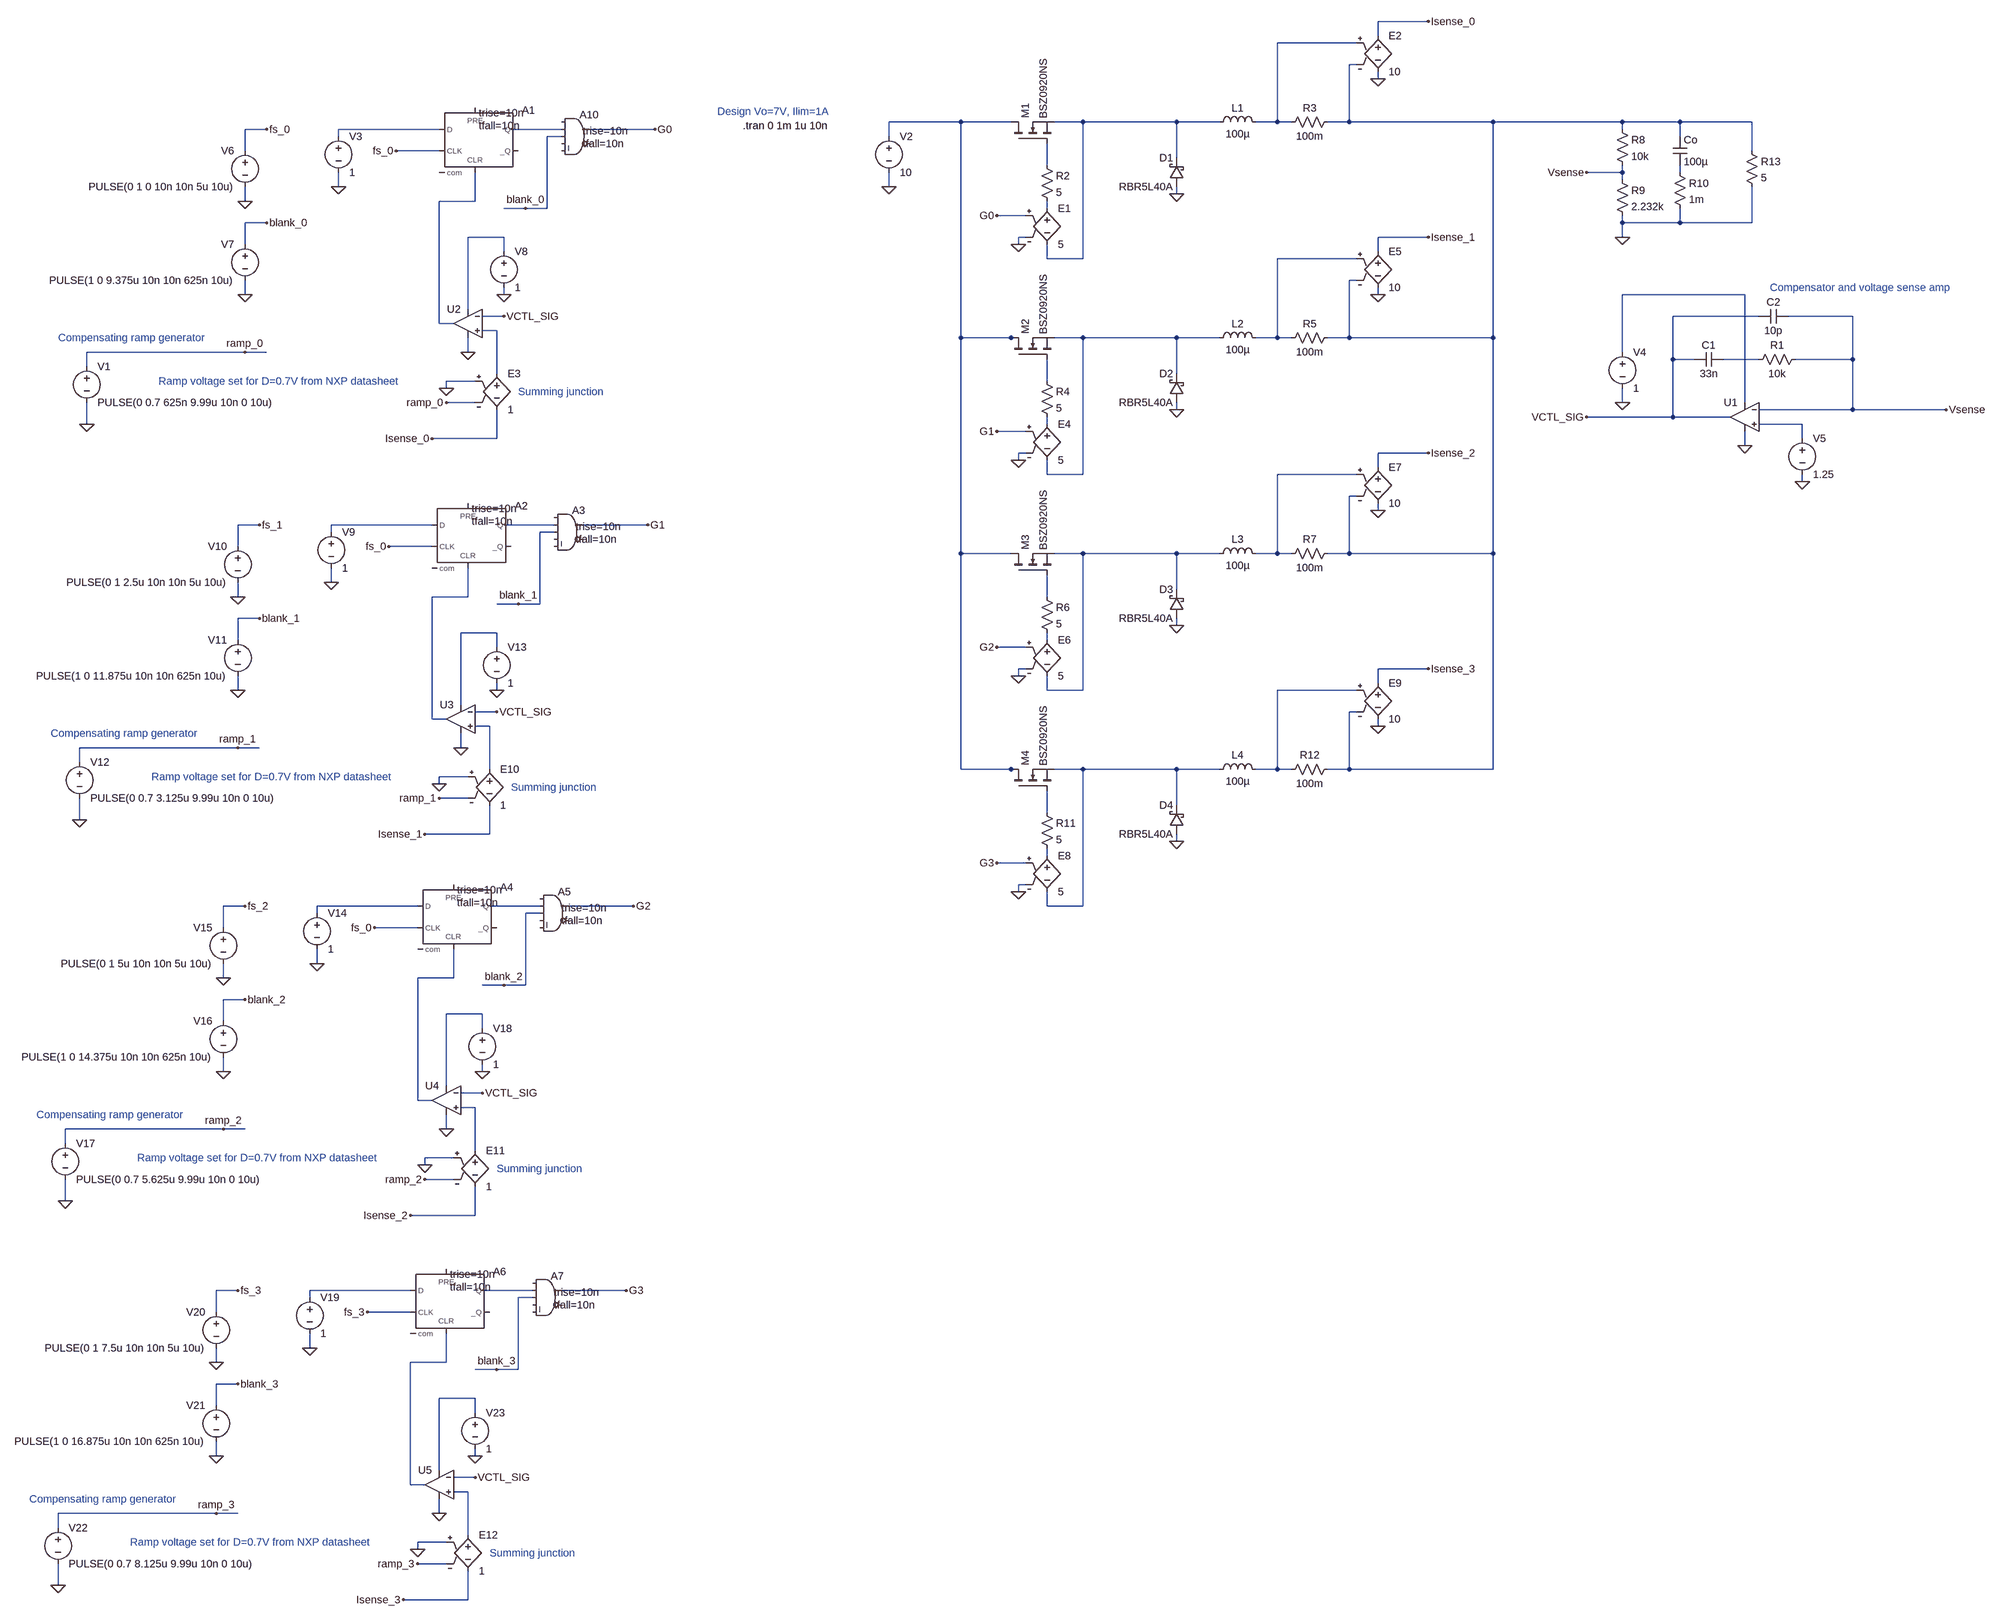
[diagram p0: schematic QuadPhase.asc]
QuadPhase.asc, the LTspice schematic file:
Version 4
SHEET 1 3300 3484
WIRE 1088 -112 976 -112
WIRE 976 -80 976 -112
WIRE 928 -64 752 -64
WIRE 928 -16 912 -16
WIRE 976 16 976 0
WIRE 48 112 -112 112
WIRE 160 112 48 112
WIRE 320 112 256 112
WIRE 528 112 320 112
WIRE 624 112 528 112
WIRE 752 112 752 -64
WIRE 752 112 704 112
WIRE 784 112 752 112
WIRE 912 112 912 -16
WIRE 912 112 864 112
WIRE 1232 112 912 112
WIRE 1520 112 1232 112
WIRE 1648 112 1520 112
WIRE 1808 112 1648 112
WIRE -1840 128 -1888 128
WIRE -1456 128 -1680 128
WIRE -1184 128 -1296 128
WIRE -976 128 -1120 128
WIRE 1520 128 1520 112
WIRE -1680 144 -1680 128
WIRE -1184 144 -1216 144
WIRE -112 144 -112 112
WIRE 1648 144 1648 112
WIRE -1888 176 -1888 128
WIRE -1456 176 -1552 176
WIRE 1808 176 1808 112
WIRE 528 192 528 112
WIRE 240 208 240 160
WIRE 1520 224 1520 208
WIRE 1520 224 1440 224
WIRE 1648 224 1648 208
WIRE 1520 240 1520 224
WIRE -1680 256 -1680 224
WIRE -112 256 -112 224
WIRE 528 272 528 256
WIRE -1888 288 -1888 256
WIRE -1376 288 -1376 224
WIRE -1376 288 -1456 288
WIRE -1264 304 -1312 304
WIRE -1216 304 -1216 144
WIRE -1216 304 -1264 304
WIRE 240 304 240 288
WIRE 192 320 128 320
WIRE -1840 336 -1888 336
WIRE 1520 336 1520 320
WIRE 1648 336 1648 304
WIRE 1648 336 1520 336
WIRE 1808 336 1808 256
WIRE 1808 336 1648 336
WIRE -1312 368 -1392 368
WIRE 192 368 176 368
WIRE 1088 368 976 368
WIRE 1520 368 1520 336
WIRE -1888 384 -1888 336
WIRE 176 384 176 368
WIRE -1312 400 -1312 368
WIRE 976 400 976 368
WIRE 240 416 240 384
WIRE 320 416 320 112
WIRE 320 416 240 416
WIRE 928 416 752 416
WIRE 928 464 912 464
WIRE -1888 496 -1888 464
WIRE -1312 496 -1312 480
WIRE 976 496 976 480
WIRE 1792 496 1520 496
WIRE -1392 528 -1392 368
WIRE -1312 544 -1360 544
WIRE 1824 544 1632 544
WIRE 2032 544 1888 544
WIRE -1456 560 -1456 288
WIRE -1424 560 -1456 560
WIRE -1328 576 -1360 576
WIRE 48 592 48 112
WIRE 160 592 48 592
WIRE 176 592 160 592
WIRE 320 592 256 592
WIRE 528 592 320 592
WIRE 624 592 528 592
WIRE 752 592 752 416
WIRE 752 592 704 592
WIRE 784 592 752 592
WIRE 912 592 912 464
WIRE 912 592 864 592
WIRE 1232 592 1232 112
WIRE 1232 592 912 592
WIRE -1888 624 -2240 624
WIRE -1840 624 -1888 624
WIRE -1392 624 -1392 592
WIRE 1520 624 1520 496
WIRE 1632 640 1632 544
WIRE 1680 640 1632 640
WIRE 1824 640 1744 640
WIRE 2032 640 2032 544
WIRE 2032 640 1904 640
WIRE -2240 656 -2240 624
WIRE -1328 672 -1328 576
WIRE 528 672 528 592
WIRE -1376 688 -1440 688
WIRE 240 688 240 640
WIRE -1440 704 -1440 688
WIRE -1376 736 -1440 736
WIRE 1520 736 1520 704
WIRE 1792 736 1792 496
WIRE 528 752 528 736
WIRE 2032 752 2032 640
WIRE 2032 752 1824 752
WIRE 2240 752 2032 752
WIRE 1632 768 1632 640
WIRE 1632 768 1440 768
WIRE 1760 768 1632 768
WIRE -2240 784 -2240 736
WIRE 240 784 240 768
WIRE 1920 784 1824 784
WIRE 192 800 128 800
WIRE -1328 816 -1328 752
WIRE -1328 816 -1472 816
WIRE 1920 816 1920 784
WIRE 1792 832 1792 800
WIRE 192 848 176 848
WIRE 1088 848 976 848
WIRE 176 864 176 848
WIRE 976 880 976 848
WIRE 240 896 240 864
WIRE 320 896 320 592
WIRE 320 896 240 896
WIRE 928 896 752 896
WIRE 1920 912 1920 896
WIRE 928 944 912 944
WIRE 976 976 976 960
WIRE -1856 1008 -1904 1008
WIRE -1472 1008 -1696 1008
WIRE -1200 1008 -1312 1008
WIRE -992 1008 -1136 1008
WIRE -1696 1024 -1696 1008
WIRE -1200 1024 -1232 1024
WIRE -1904 1056 -1904 1008
WIRE -1472 1056 -1568 1056
WIRE 48 1072 48 592
WIRE 160 1072 48 1072
WIRE 320 1072 256 1072
WIRE 528 1072 320 1072
WIRE 624 1072 528 1072
WIRE 752 1072 752 896
WIRE 752 1072 704 1072
WIRE 784 1072 752 1072
WIRE 912 1072 912 944
WIRE 912 1072 864 1072
WIRE 1232 1072 1232 592
WIRE 1232 1072 912 1072
WIRE -1696 1136 -1696 1104
WIRE 528 1152 528 1072
WIRE -1904 1168 -1904 1136
WIRE -1392 1168 -1392 1104
WIRE -1392 1168 -1472 1168
WIRE 240 1168 240 1120
WIRE -1280 1184 -1328 1184
WIRE -1232 1184 -1232 1024
WIRE -1232 1184 -1280 1184
WIRE -1856 1216 -1904 1216
WIRE 528 1232 528 1216
WIRE -1328 1248 -1408 1248
WIRE -1904 1264 -1904 1216
WIRE 240 1264 240 1248
WIRE -1328 1280 -1328 1248
WIRE 192 1280 128 1280
WIRE 192 1328 176 1328
WIRE 1088 1328 976 1328
WIRE 176 1344 176 1328
WIRE 976 1360 976 1328
WIRE -1904 1376 -1904 1344
WIRE -1328 1376 -1328 1360
WIRE 240 1376 240 1344
WIRE 320 1376 320 1072
WIRE 320 1376 240 1376
WIRE 928 1376 752 1376
WIRE -1408 1408 -1408 1248
WIRE -1328 1424 -1376 1424
WIRE 928 1424 912 1424
WIRE -1472 1440 -1472 1168
WIRE -1440 1440 -1472 1440
WIRE -1344 1456 -1376 1456
WIRE 976 1456 976 1440
WIRE -1904 1504 -2256 1504
WIRE -1856 1504 -1904 1504
WIRE -1408 1504 -1408 1472
WIRE -2256 1536 -2256 1504
WIRE -1344 1552 -1344 1456
WIRE 48 1552 48 1072
WIRE 160 1552 48 1552
WIRE 176 1552 160 1552
WIRE 320 1552 256 1552
WIRE 528 1552 320 1552
WIRE 624 1552 528 1552
WIRE 752 1552 752 1376
WIRE 752 1552 704 1552
WIRE 784 1552 752 1552
WIRE 912 1552 912 1424
WIRE 912 1552 864 1552
WIRE 1232 1552 1232 1072
WIRE 1232 1552 912 1552
WIRE -1392 1568 -1456 1568
WIRE -1456 1584 -1456 1568
WIRE -1392 1616 -1456 1616
WIRE 528 1632 528 1552
WIRE 240 1648 240 1600
WIRE -2256 1664 -2256 1616
WIRE -1344 1696 -1344 1632
WIRE -1344 1696 -1488 1696
WIRE 528 1712 528 1696
WIRE 240 1744 240 1728
WIRE 192 1760 128 1760
WIRE 192 1808 176 1808
WIRE 176 1824 176 1808
WIRE -1888 1856 -1936 1856
WIRE -1504 1856 -1728 1856
WIRE -1232 1856 -1344 1856
WIRE -1024 1856 -1168 1856
WIRE 240 1856 240 1824
WIRE 320 1856 320 1552
WIRE 320 1856 240 1856
WIRE -1728 1872 -1728 1856
WIRE -1232 1872 -1264 1872
WIRE -1936 1904 -1936 1856
WIRE -1504 1904 -1600 1904
WIRE -1728 1984 -1728 1952
WIRE -1936 2016 -1936 1984
WIRE -1424 2016 -1424 1952
WIRE -1424 2016 -1504 2016
WIRE -1312 2032 -1360 2032
WIRE -1264 2032 -1264 1872
WIRE -1264 2032 -1312 2032
WIRE -1888 2064 -1936 2064
WIRE -1360 2096 -1440 2096
WIRE -1936 2112 -1936 2064
WIRE -1360 2128 -1360 2096
WIRE -1936 2224 -1936 2192
WIRE -1360 2224 -1360 2208
WIRE -1440 2256 -1440 2096
WIRE -1360 2272 -1408 2272
WIRE -1504 2288 -1504 2016
WIRE -1472 2288 -1504 2288
WIRE -1376 2304 -1408 2304
WIRE -1936 2352 -2288 2352
WIRE -1888 2352 -1936 2352
WIRE -1440 2352 -1440 2320
WIRE -2288 2384 -2288 2352
WIRE -1376 2400 -1376 2304
WIRE -1424 2416 -1488 2416
WIRE -1488 2432 -1488 2416
WIRE -1424 2464 -1488 2464
WIRE -2288 2512 -2288 2464
WIRE -1376 2544 -1376 2480
WIRE -1376 2544 -1520 2544
WIRE -1904 2736 -1952 2736
WIRE -1520 2736 -1744 2736
WIRE -1248 2736 -1360 2736
WIRE -1040 2736 -1184 2736
WIRE -1744 2752 -1744 2736
WIRE -1248 2752 -1280 2752
WIRE -1952 2784 -1952 2736
WIRE -1520 2784 -1616 2784
WIRE -1744 2864 -1744 2832
WIRE -1952 2896 -1952 2864
WIRE -1440 2896 -1440 2832
WIRE -1440 2896 -1520 2896
WIRE -1328 2912 -1376 2912
WIRE -1280 2912 -1280 2752
WIRE -1280 2912 -1328 2912
WIRE -1904 2944 -1952 2944
WIRE -1376 2976 -1456 2976
WIRE -1952 2992 -1952 2944
WIRE -1376 3008 -1376 2976
WIRE -1952 3104 -1952 3072
WIRE -1376 3104 -1376 3088
WIRE -1456 3136 -1456 2976
WIRE -1376 3152 -1424 3152
WIRE -1520 3168 -1520 2896
WIRE -1488 3168 -1520 3168
WIRE -1392 3184 -1424 3184
WIRE -1952 3232 -2304 3232
WIRE -1904 3232 -1952 3232
WIRE -1456 3232 -1456 3200
WIRE -2304 3264 -2304 3232
WIRE -1392 3280 -1392 3184
WIRE -1440 3296 -1504 3296
WIRE -1504 3312 -1504 3296
WIRE -1440 3344 -1504 3344
WIRE -2304 3392 -2304 3344
WIRE -1392 3424 -1392 3360
WIRE -1392 3424 -1536 3424
FLAG -112 256 0
FLAG 528 272 0
FLAG 176 384 0
FLAG -1680 256 0
FLAG 976 16 0
FLAG 1088 -112 Isense_0
FLAG -1552 176 fs_0
FLAG -1264 304 blank_0
FLAG 1440 224 Vsense
FLAG -1888 288 0
FLAG -1840 128 fs_0
FLAG -1888 496 0
FLAG -1840 336 blank_0
FLAG -2240 784 0
FLAG -1888 624 ramp_0
FLAG -1472 816 Isense_0
FLAG -1440 704 0
FLAG -1440 736 ramp_0
FLAG 1792 832 0
FLAG 1520 736 0
FLAG 1920 912 0
FLAG 2240 752 Vsense
FLAG -1312 496 0
FLAG -1392 624 0
FLAG 1440 768 VCTL_SIG
FLAG -1312 544 VCTL_SIG
FLAG -976 128 G0
FLAG 128 320 G0
FLAG 528 752 0
FLAG 176 864 0
FLAG 976 496 0
FLAG 1088 368 Isense_1
FLAG 128 800 G1
FLAG 1520 368 0
FLAG 528 1232 0
FLAG 176 1344 0
FLAG 976 976 0
FLAG 1088 848 Isense_2
FLAG 128 1280 G2
FLAG 528 1712 0
FLAG 176 1824 0
FLAG 976 1456 0
FLAG 1088 1328 Isense_3
FLAG 128 1760 G3
FLAG -1696 1136 0
FLAG -1568 1056 fs_0
FLAG -1280 1184 blank_1
FLAG -1904 1168 0
FLAG -1856 1008 fs_1
FLAG -1904 1376 0
FLAG -1856 1216 blank_1
FLAG -2256 1664 0
FLAG -1904 1504 ramp_1
FLAG -1488 1696 Isense_1
FLAG -1456 1584 0
FLAG -1456 1616 ramp_1
FLAG -1328 1376 0
FLAG -1408 1504 0
FLAG -1328 1424 VCTL_SIG
FLAG -992 1008 G1
FLAG -1728 1984 0
FLAG -1600 1904 fs_0
FLAG -1312 2032 blank_2
FLAG -1936 2016 0
FLAG -1888 1856 fs_2
FLAG -1936 2224 0
FLAG -1888 2064 blank_2
FLAG -2288 2512 0
FLAG -1936 2352 ramp_2
FLAG -1520 2544 Isense_2
FLAG -1488 2432 0
FLAG -1488 2464 ramp_2
FLAG -1360 2224 0
FLAG -1440 2352 0
FLAG -1360 2272 VCTL_SIG
FLAG -1024 1856 G2
FLAG -1744 2864 0
FLAG -1616 2784 fs_3
FLAG -1328 2912 blank_3
FLAG -1952 2896 0
FLAG -1904 2736 fs_3
FLAG -1952 3104 0
FLAG -1904 2944 blank_3
FLAG -2304 3392 0
FLAG -1952 3232 ramp_3
FLAG -1536 3424 Isense_3
FLAG -1504 3312 0
FLAG -1504 3344 ramp_3
FLAG -1376 3104 0
FLAG -1456 3232 0
FLAG -1376 3152 VCTL_SIG
FLAG -1040 2736 G3
SYMBOL nmos 160 160 R270
SYMATTR InstName M1
SYMATTR Value BSZ0920NS
SYMBOL voltage -112 128 R0
WINDOW 123 0 0 Left 0
WINDOW 39 0 0 Left 0
SYMATTR InstName V2
SYMATTR Value 10
SYMBOL res 224 192 R0
SYMATTR InstName R2
SYMATTR Value 5
SYMBOL schottky 544 256 R180
WINDOW 0 24 64 Left 2
WINDOW 3 24 0 Left 2
SYMATTR InstName D1
SYMATTR Value RBR5L40A
SYMATTR Description Diode
SYMATTR Type diode
SYMBOL ind 608 128 R270
WINDOW 0 32 56 VTop 2
WINDOW 3 5 56 VBottom 2
SYMATTR InstName L1
SYMATTR Value 100µ
SYMATTR SpiceLine Rser=0.115 Cpar=7.036p
SYMBOL cap 1632 144 R0
SYMATTR InstName Co
SYMATTR Value 100µ
SYMBOL res 880 96 R90
WINDOW 0 0 56 VBottom 2
WINDOW 3 32 56 VTop 2
SYMATTR InstName R3
SYMATTR Value 100m
SYMBOL Digital\\dflop -1376 80 R0
WINDOW 3 8 12 Left 2
WINDOW 123 8 40 Left 2
SYMATTR Value trise=10n
SYMATTR Value2 tfall=10n
SYMATTR InstName A1
SYMBOL e 240 288 R0
SYMATTR InstName E1
SYMATTR Value 5
SYMBOL voltage -1680 128 R0
WINDOW 123 0 0 Left 0
WINDOW 39 0 0 Left 0
SYMATTR InstName V3
SYMATTR Value 1
SYMBOL e 976 -96 R0
SYMATTR InstName E2
SYMATTR Value 10
SYMBOL Digital\\and -1152 80 R0
WINDOW 3 16 52 Left 2
WINDOW 123 16 80 Left 2
SYMATTR Value trise=10n
SYMATTR Value2 tfall=10n
SYMATTR InstName A10
SYMBOL res 1504 112 R0
SYMATTR InstName R8
SYMATTR Value 10k
SYMBOL res 1504 224 R0
SYMATTR InstName R9
SYMATTR Value 2.232k
SYMBOL res 1632 208 R0
SYMATTR InstName R10
SYMATTR Value 1m
SYMBOL voltage -1888 160 M0
WINDOW 123 0 0 Left 0
WINDOW 39 0 0 Left 0
SYMATTR InstName V6
SYMATTR Value PULSE(0 1 0 10n 10n 5u 10u)
SYMBOL voltage -1888 368 M0
WINDOW 123 0 0 Left 0
WINDOW 39 0 0 Left 0
SYMATTR InstName V7
SYMATTR Value PULSE(1 0 9.375u 10n 10n 625n 10u)
SYMBOL voltage -2240 640 R0
WINDOW 123 0 0 Left 0
WINDOW 39 0 0 Left 0
SYMATTR InstName V1
SYMATTR Value PULSE(0 0.7 625n 9.99u 10n 0 10u)
SYMBOL e -1328 656 R0
SYMATTR InstName E3
SYMATTR Value 1
SYMBOL Opamps\\UniversalOpamp2 1792 768 M0
SYMATTR InstName U1
SYMATTR Value2 Avol=10Meg GBW=10Meg Slew=10Meg
SYMBOL voltage 1520 608 R0
WINDOW 123 0 0 Left 0
WINDOW 39 0 0 Left 0
SYMATTR InstName V4
SYMATTR Value 1
SYMBOL res 1920 624 R90
WINDOW 0 0 56 VBottom 2
WINDOW 3 32 56 VTop 2
SYMATTR InstName R1
SYMATTR Value 10k
SYMBOL cap 1744 624 R90
WINDOW 0 0 32 VBottom 2
WINDOW 3 32 32 VTop 2
SYMATTR InstName C1
SYMATTR Value 33n
SYMBOL cap 1888 528 R90
WINDOW 0 0 32 VBottom 2
WINDOW 3 32 32 VTop 2
SYMATTR InstName C2
SYMATTR Value 10p
SYMBOL voltage 1920 800 R0
WINDOW 123 0 0 Left 0
WINDOW 39 0 0 Left 0
SYMATTR InstName V5
SYMATTR Value 1.25
SYMBOL Opamps\\UniversalOpamp2 -1392 560 M0
SYMATTR InstName U2
SYMATTR Value2 Avol=10Meg GBW=10Meg Slew=10Meg
SYMBOL voltage -1312 384 R0
WINDOW 123 0 0 Left 0
WINDOW 39 0 0 Left 0
SYMATTR InstName V8
SYMATTR Value 1
SYMBOL nmos 160 640 R270
SYMATTR InstName M2
SYMATTR Value BSZ0920NS
SYMBOL res 224 672 R0
SYMATTR InstName R4
SYMATTR Value 5
SYMBOL schottky 544 736 R180
WINDOW 0 24 64 Left 2
WINDOW 3 24 0 Left 2
SYMATTR InstName D2
SYMATTR Value RBR5L40A
SYMATTR Description Diode
SYMATTR Type diode
SYMBOL ind 608 608 R270
WINDOW 0 32 56 VTop 2
WINDOW 3 5 56 VBottom 2
SYMATTR InstName L2
SYMATTR Value 100µ
SYMATTR SpiceLine Rser=0.115 Cpar=7.036p
SYMBOL res 880 576 R90
WINDOW 0 0 56 VBottom 2
WINDOW 3 32 56 VTop 2
SYMATTR InstName R5
SYMATTR Value 100m
SYMBOL e 240 768 R0
SYMATTR InstName E4
SYMATTR Value 5
SYMBOL e 976 384 R0
SYMATTR InstName E5
SYMATTR Value 10
SYMBOL nmos 160 1120 R270
SYMATTR InstName M3
SYMATTR Value BSZ0920NS
SYMBOL res 224 1152 R0
SYMATTR InstName R6
SYMATTR Value 5
SYMBOL schottky 544 1216 R180
WINDOW 0 24 64 Left 2
WINDOW 3 24 0 Left 2
SYMATTR InstName D3
SYMATTR Value RBR5L40A
SYMATTR Description Diode
SYMATTR Type diode
SYMBOL ind 608 1088 R270
WINDOW 0 32 56 VTop 2
WINDOW 3 5 56 VBottom 2
SYMATTR InstName L3
SYMATTR Value 100µ
SYMATTR SpiceLine Rser=0.115 Cpar=7.036p
SYMBOL res 880 1056 R90
WINDOW 0 0 56 VBottom 2
WINDOW 3 32 56 VTop 2
SYMATTR InstName R7
SYMATTR Value 100m
SYMBOL e 240 1248 R0
SYMATTR InstName E6
SYMATTR Value 5
SYMBOL e 976 864 R0
SYMATTR InstName E7
SYMATTR Value 10
SYMBOL nmos 160 1600 R270
SYMATTR InstName M4
SYMATTR Value BSZ0920NS
SYMBOL res 224 1632 R0
SYMATTR InstName R11
SYMATTR Value 5
SYMBOL schottky 544 1696 R180
WINDOW 0 24 64 Left 2
WINDOW 3 24 0 Left 2
SYMATTR InstName D4
SYMATTR Value RBR5L40A
SYMATTR Description Diode
SYMATTR Type diode
SYMBOL ind 608 1568 R270
WINDOW 0 32 56 VTop 2
WINDOW 3 5 56 VBottom 2
SYMATTR InstName L4
SYMATTR Value 100µ
SYMATTR SpiceLine Rser=0.115 Cpar=7.036p
SYMBOL res 880 1536 R90
WINDOW 0 0 56 VBottom 2
WINDOW 3 32 56 VTop 2
SYMATTR InstName R12
SYMATTR Value 100m
SYMBOL e 240 1728 R0
SYMATTR InstName E8
SYMATTR Value 5
SYMBOL e 976 1344 R0
SYMATTR InstName E9
SYMATTR Value 10
SYMBOL Digital\\dflop -1392 960 R0
WINDOW 3 8 12 Left 2
WINDOW 123 8 40 Left 2
SYMATTR Value trise=10n
SYMATTR Value2 tfall=10n
SYMATTR InstName A2
SYMBOL voltage -1696 1008 R0
WINDOW 123 0 0 Left 0
WINDOW 39 0 0 Left 0
SYMATTR InstName V9
SYMATTR Value 1
SYMBOL Digital\\and -1168 960 R0
WINDOW 3 16 52 Left 2
WINDOW 123 16 80 Left 2
SYMATTR Value trise=10n
SYMATTR Value2 tfall=10n
SYMATTR InstName A3
SYMBOL voltage -1904 1040 M0
WINDOW 123 0 0 Left 0
WINDOW 39 0 0 Left 0
SYMATTR InstName V10
SYMATTR Value PULSE(0 1 2.5u 10n 10n 5u 10u)
SYMBOL voltage -1904 1248 M0
WINDOW 123 0 0 Left 0
WINDOW 39 0 0 Left 0
SYMATTR InstName V11
SYMATTR Value PULSE(1 0 11.875u 10n 10n 625n 10u)
SYMBOL voltage -2256 1520 R0
WINDOW 123 0 0 Left 0
WINDOW 39 0 0 Left 0
SYMATTR InstName V12
SYMATTR Value PULSE(0 0.7 3.125u 9.99u 10n 0 10u)
SYMBOL e -1344 1536 R0
SYMATTR InstName E10
SYMATTR Value 1
SYMBOL Opamps\\UniversalOpamp2 -1408 1440 M0
SYMATTR InstName U3
SYMATTR Value2 Avol=10Meg GBW=10Meg Slew=10Meg
SYMBOL voltage -1328 1264 R0
WINDOW 123 0 0 Left 0
WINDOW 39 0 0 Left 0
SYMATTR InstName V13
SYMATTR Value 1
SYMBOL Digital\\dflop -1424 1808 R0
WINDOW 3 8 12 Left 2
WINDOW 123 8 40 Left 2
SYMATTR Value trise=10n
SYMATTR Value2 tfall=10n
SYMATTR InstName A4
SYMBOL voltage -1728 1856 R0
WINDOW 123 0 0 Left 0
WINDOW 39 0 0 Left 0
SYMATTR InstName V14
SYMATTR Value 1
SYMBOL Digital\\and -1200 1808 R0
WINDOW 3 16 52 Left 2
WINDOW 123 16 80 Left 2
SYMATTR Value trise=10n
SYMATTR Value2 tfall=10n
SYMATTR InstName A5
SYMBOL voltage -1936 1888 M0
WINDOW 123 0 0 Left 0
WINDOW 39 0 0 Left 0
SYMATTR InstName V15
SYMATTR Value PULSE(0 1 5u 10n 10n 5u 10u)
SYMBOL voltage -1936 2096 M0
WINDOW 123 0 0 Left 0
WINDOW 39 0 0 Left 0
SYMATTR InstName V16
SYMATTR Value PULSE(1 0 14.375u 10n 10n 625n 10u)
SYMBOL voltage -2288 2368 R0
WINDOW 123 0 0 Left 0
WINDOW 39 0 0 Left 0
SYMATTR InstName V17
SYMATTR Value PULSE(0 0.7 5.625u 9.99u 10n 0 10u)
SYMBOL e -1376 2384 R0
SYMATTR InstName E11
SYMATTR Value 1
SYMBOL Opamps\\UniversalOpamp2 -1440 2288 M0
SYMATTR InstName U4
SYMATTR Value2 Avol=10Meg GBW=10Meg Slew=10Meg
SYMBOL voltage -1360 2112 R0
WINDOW 123 0 0 Left 0
WINDOW 39 0 0 Left 0
SYMATTR InstName V18
SYMATTR Value 1
SYMBOL Digital\\dflop -1440 2688 R0
WINDOW 3 8 12 Left 2
WINDOW 123 8 40 Left 2
SYMATTR Value trise=10n
SYMATTR Value2 tfall=10n
SYMATTR InstName A6
SYMBOL voltage -1744 2736 R0
WINDOW 123 0 0 Left 0
WINDOW 39 0 0 Left 0
SYMATTR InstName V19
SYMATTR Value 1
SYMBOL Digital\\and -1216 2688 R0
WINDOW 3 16 52 Left 2
WINDOW 123 16 80 Left 2
SYMATTR Value trise=10n
SYMATTR Value2 tfall=10n
SYMATTR InstName A7
SYMBOL voltage -1952 2768 M0
WINDOW 123 0 0 Left 0
WINDOW 39 0 0 Left 0
SYMATTR InstName V20
SYMATTR Value PULSE(0 1 7.5u 10n 10n 5u 10u)
SYMBOL voltage -1952 2976 M0
WINDOW 123 0 0 Left 0
WINDOW 39 0 0 Left 0
SYMATTR InstName V21
SYMATTR Value PULSE(1 0 16.875u 10n 10n 625n 10u)
SYMBOL voltage -2304 3248 R0
WINDOW 123 0 0 Left 0
WINDOW 39 0 0 Left 0
SYMATTR InstName V22
SYMATTR Value PULSE(0 0.7 8.125u 9.99u 10n 0 10u)
SYMBOL e -1392 3264 R0
SYMATTR InstName E12
SYMATTR Value 1
SYMBOL Opamps\\UniversalOpamp2 -1456 3168 M0
SYMATTR InstName U5
SYMATTR Value2 Avol=10Meg GBW=10Meg Slew=10Meg
SYMBOL voltage -1376 2992 R0
WINDOW 123 0 0 Left 0
WINDOW 39 0 0 Left 0
SYMATTR InstName V23
SYMATTR Value 1
SYMBOL res 1792 160 R0
SYMATTR InstName R13
SYMATTR Value 5
TEXT -464 120 Left 2 !.tran 0 1m 1u 10n
TEXT -520 88 Left 2 ;Design Vo=7V, Ilim=1A
TEXT -2304 592 Left 2 ;Compensating ramp generator
TEXT -2080 688 Left 2 ;Ramp voltage set for D=0.7V from NXP datasheet
TEXT -1280 712 Left 2 ;Summing junction
TEXT 1848 480 Left 2 ;Compensator and voltage sense amp
TEXT -2320 1472 Left 2 ;Compensating ramp generator
TEXT -2096 1568 Left 2 ;Ramp voltage set for D=0.7V from NXP datasheet
TEXT -1296 1592 Left 2 ;Summing junction
TEXT -2352 2320 Left 2 ;Compensating ramp generator
TEXT -2128 2416 Left 2 ;Ramp voltage set for D=0.7V from NXP datasheet
TEXT -1328 2440 Left 2 ;Summing junction
TEXT -2368 3200 Left 2 ;Compensating ramp generator
TEXT -2144 3296 Left 2 ;Ramp voltage set for D=0.7V from NXP datasheet
TEXT -1344 3320 Left 2 ;Summing junction

The netlist it stands for:
* QuadPhase.asc
M1 N003 N007 N004 N004 BSZ0920NS
V2 N003 0 10
R2 N007 N010 5
D1 0 N004 RBR5L40A
L1 N004 N001 100µ Rser=0.115 Cpar=7.036p
Co N002 N008 100µ
R3 N002 N001 100m
A1 N005 0 fs_0 0 N009 0 N006 0 DFLOP trise=10n tfall=10n
E1 N010 N004 G0 0 5
V3 N005 0 1
E2 Isense_0 0 N001 N002 10
A10 0 N006 blank_0 0 0 0 G0 0 AND trise=10n tfall=10n
R8 N002 Vsense 10k
R9 Vsense 0 2.232k
R10 N008 0 1m
V6 fs_0 0 PULSE(0 1 0 10n 10n 5u 10u)
V7 blank_0 0 PULSE(1 0 9.375u 10n 10n 625n 10u)
V1 ramp_0 0 PULSE(0 0.7 625n 9.99u 10n 0 10u)
E3 N014 Isense_0 0 ramp_0 1
XU1 N019 Vsense N013 0 VCTL_SIG level.2 Avol=10Meg GBW=10Meg Slew=10Meg ilimit=25m rail=0 Vos=0 phimargin=45 en=0 enk=0 in=0 ink=0 Rin=500Meg  ; pins IN+ IN- V+ V- OUT
V4 N013 0 1
R1 Vsense N016 10k
C1 N016 VCTL_SIG 33n
C2 Vsense VCTL_SIG 10p
V5 N019 0 1.25
XU2 N014 VCTL_SIG N011 0 N009 level.2 Avol=10Meg GBW=10Meg Slew=10Meg ilimit=25m rail=0 Vos=0 phimargin=45 en=0 enk=0 in=0 ink=0 Rin=500Meg  ; pins IN+ IN- V+ V- OUT
V8 N011 0 1
M2 N003 N017 N015 N015 BSZ0920NS
R4 N017 N018 5
D2 0 N015 RBR5L40A
L2 N015 N012 100µ Rser=0.115 Cpar=7.036p
R5 N002 N012 100m
E4 N018 N015 G1 0 5
E5 Isense_1 0 N012 N002 10
M3 N003 N025 N023 N023 BSZ0920NS
R6 N025 N027 5
D3 0 N023 RBR5L40A
L3 N023 N020 100µ Rser=0.115 Cpar=7.036p
R7 N002 N020 100m
E6 N027 N023 G2 0 5
E7 Isense_2 0 N020 N002 10
M4 N003 N031 N030 N030 BSZ0920NS
R11 N031 N032 5
D4 0 N030 RBR5L40A
L4 N030 N028 100µ Rser=0.115 Cpar=7.036p
R12 N002 N028 100m
E8 N032 N030 G3 0 5
E9 Isense_3 0 N028 N002 10
A2 N021 0 fs_0 0 N024 0 N022 0 DFLOP trise=10n tfall=10n
V9 N021 0 1
A3 0 N022 blank_1 0 0 0 G1 0 AND trise=10n tfall=10n
V10 fs_1 0 PULSE(0 1 2.5u 10n 10n 5u 10u)
V11 blank_1 0 PULSE(1 0 11.875u 10n 10n 625n 10u)
V12 ramp_1 0 PULSE(0 0.7 3.125u 9.99u 10n 0 10u)
E10 N029 Isense_1 0 ramp_1 1
XU3 N029 VCTL_SIG N026 0 N024 level.2 Avol=10Meg GBW=10Meg Slew=10Meg ilimit=25m rail=0 Vos=0 phimargin=45 en=0 enk=0 in=0 ink=0 Rin=500Meg  ; pins IN+ IN- V+ V- OUT
V13 N026 0 1
A4 N033 0 fs_0 0 N035 0 N034 0 DFLOP trise=10n tfall=10n
V14 N033 0 1
A5 0 N034 blank_2 0 0 0 G2 0 AND trise=10n tfall=10n
V15 fs_2 0 PULSE(0 1 5u 10n 10n 5u 10u)
V16 blank_2 0 PULSE(1 0 14.375u 10n 10n 625n 10u)
V17 ramp_2 0 PULSE(0 0.7 5.625u 9.99u 10n 0 10u)
E11 N037 Isense_2 0 ramp_2 1
XU4 N037 VCTL_SIG N036 0 N035 level.2 Avol=10Meg GBW=10Meg Slew=10Meg ilimit=25m rail=0 Vos=0 phimargin=45 en=0 enk=0 in=0 ink=0 Rin=500Meg  ; pins IN+ IN- V+ V- OUT
V18 N036 0 1
A6 N038 0 fs_3 0 N040 0 N039 0 DFLOP trise=10n tfall=10n
V19 N038 0 1
A7 0 N039 blank_3 0 0 0 G3 0 AND trise=10n tfall=10n
V20 fs_3 0 PULSE(0 1 7.5u 10n 10n 5u 10u)
V21 blank_3 0 PULSE(1 0 16.875u 10n 10n 625n 10u)
V22 ramp_3 0 PULSE(0 0.7 8.125u 9.99u 10n 0 10u)
E12 N042 Isense_3 0 ramp_3 1
XU5 N042 VCTL_SIG N041 0 N040 level.2 Avol=10Meg GBW=10Meg Slew=10Meg ilimit=25m rail=0 Vos=0 phimargin=45 en=0 enk=0 in=0 ink=0 Rin=500Meg  ; pins IN+ IN- V+ V- OUT
V23 N041 0 1
R13 N002 0 5
.model D D
.lib standard.dio
.model NMOS NMOS
.model PMOS PMOS
.lib standard.mos
.tran 0 1m 1u 10n
* Design Vo=7V, Ilim=1A
* Compensating ramp generator
* Ramp voltage set for D=0.7V from NXP datasheet
* Summing junction
* Compensator and voltage sense amp
* Compensating ramp generator
* Ramp voltage set for D=0.7V from NXP datasheet
* Summing junction
* Compensating ramp generator
* Ramp voltage set for D=0.7V from NXP datasheet
* Summing junction
* Compensating ramp generator
* Ramp voltage set for D=0.7V from NXP datasheet
* Summing junction
.lib UniversalOpamps2.sub
.backanno
.end